# Altium project AvtomotiveServo.PrjPcb
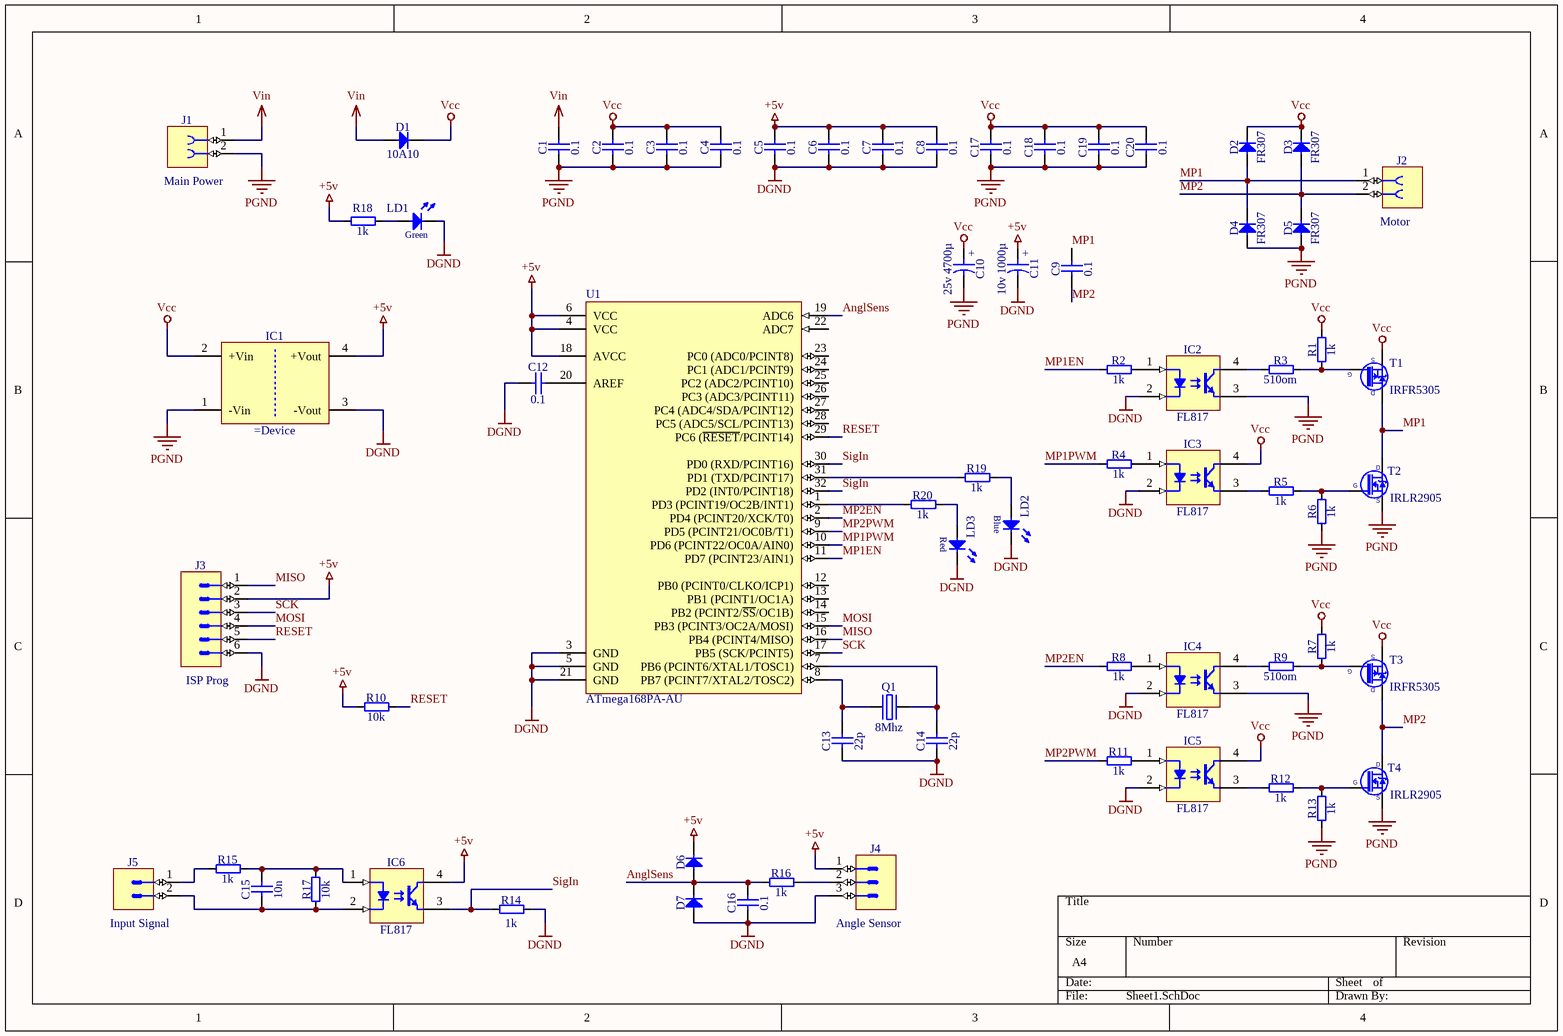
[diagram p0: Sheet1.SchDoc]
1 sheet, 67 parts. Net scope: global (net labels, ports and power ports of the same name join across sheets).
Board file: PCB1.PcbDoc

## Sheet Sheet1.SchDoc
size A4; DrawnBy: Sobchuk Denis

### Parts
C1  0.1  [0402]
C2  0.1  [0402]
C3  0.1  [0402]
C4  0.1  [0402]
C5  0.1  [0402]
C6  0.1  [0402]
C7  0.1  [0402]
C8  0.1  [0402]
C9  0.1  [0402]
C10  25v 4700µ  [Cap25v4700mkf]
C11  10v 1000µ  [CAPPR350W80D850H1300]
C12  0.1  [0402]
C13  22p  [0402]
C14  22p  [0402]
C15  10n  [0402]
C16  0.1  [0402]
C17  0.1  [0402]
C18  0.1  [0402]
C19  0.1  [0402]
C20  0.1  [0402]
D1  10A10  [10A10]
D2  FR307  [DO-27]
D3  FR307  [DO-27]
D4  FR307  [DO-27]
D5  FR307  [DO-27]
D6  (no value)  [DIOMELF3515N]
D7  (no value)  [DIOMELF3515N]
IC1  (no value)  [DCDC_TRACO_TME24]
IC2  FL817  [DIP-4]
IC3  FL817  [DIP-4]
IC4  FL817  [DIP-4]
IC5  FL817  [DIP-4]
IC6  FL817  [DIP-4]
J1  Main Power  [PwrCon]
J2  Motor  [PwrCon]
J3  ISP Prog  [COMATEL_389.0358.1.06.400]
J4  Angle Sensor  [MOLEX_22-05-7038]
J5  Input Signal  [MOLEX_22-05-7028]
LD1  (no value)  [LED_5MM_GREEN_1C-2A]
LD2  (no value)  [LED_VISHAY_TSAL6200]
LD3  (no value)  [LED_5MM_RED_1C-2A]
Q1  8Mhz  [XTAL_HC-49/U]
R1  1k  [RES1016-650X250]
R2  1k  [RESC3116X65N]
R3  510om  [RES1016-650X250]
R4  1k  [RESC3116X65N]
R5  1k  [RES1016-650X250]
R6  1k  [RES1016-650X250]
R7  1k  [RES1016-650X250]
R8  1k  [RESC3116X65N]
R9  510om  [RES1016-650X250]
R10  10k  [RESC3116X65N]
R11  1k  [RESC3116X65N]
R12  1k  [RES1016-650X250]
R13  1k  [RES1016-650X250]
R14  1k  [RESC3116X65N]
R15  1k  [RESC3116X65N]
R16  1k  [RESC3116X65N]
R17  10k  [RESC3116X65N]
R18  1k  [RESC3116X65N]
R19  1k  [RESC3116X65N]
R20  1k  [RESC3116X65N]
T1  IRFR5305  [TO228P991X239-3N-R546X521]
T2  IRLR2905  [TO228P991X239-3N-R546X521]
T3  IRFR5305  [TO228P991X239-3N-R546X521]
T4  IRLR2905  [TO228P991X239-3N-R546X521]
U1  ATmega168PA-AU  [32A_M]

### Nets
+5v: C5.2 C6.2 C7.2 C8.2 C11.1 D6.1(C) IC1.4(+Vout) IC6.4(C) J3.2 J4.1 R10.1 R18.1 U1.4(VCC) U1.6(VCC) U1.18(AVCC)
DGND: C5.1 C6.1 C7.1 C8.1 C11.2 C12.1 C13.1 C14.1 C16.1 D7.2(A) IC1.3(-Vout) IC2.2(C) IC3.2(C) IC4.2(C) IC5.2(C) J3.6 J4.3 LD1.1(C) LD2.1(C) LD3.1(C) R14.2 U1.3(GND) U1.5(GND) U1.21(GND)
PGND: C1.1 C2.1 C3.1 C4.1 C10.2 C17.1 C18.1 C19.1 C20.1 D4.2(A) D5.2(A) IC1.1(-Vin) IC2.3(E) IC4.3(E) J1.2 R6.1 R13.1 T2.2(S) T4.2(S)
Vcc: C2.2 C3.2 C4.2 C10.1 C17.2 C18.2 C19.2 C20.2 D1.1(C) D2.1(C) D3.1(C) IC1.2(+Vin) IC3.4(C) IC5.4(C) R1.2 R7.2 T1.2(S) T3.2(S)
Vin: C1.2 D1.2(A) J1.1
AnglSens: C16.2 D6.2(A) D7.1(C) R16.1 U1.19(ADC6)
MISO: J3.1 U1.16(PB4_(PCINT4/MISO))
MOSI: J3.4 U1.15(PB3_(PCINT3/OC2A/MOSI))
MP1: C9.2 D2.2(A) D4.1(C) J2.1 T1.3(D) T2.3(D)
MP1EN: R2.1 U1.11(PD7_(PCINT23/AIN1))
MP1PWM: R4.1 U1.10(PD6_(PCINT22/OC0A/AIN0))
MP2: C9.1 D3.2(A) D5.1(C) J2.2 T3.3(D) T4.3(D)
MP2EN: R8.1 U1.2(PD4_(PCINT20/XCK/T0))
MP2PWM: R11.1 U1.9(PD5_(PCINT21/OC0B/T1))
RESET: J3.5 R10.2 U1.29(PC6_(~{RESET}/PCINT14))
SCK: J3.3 U1.17(PB5_(SCK/PCINT5))
SigIn: IC6.3(E) R14.1 U1.30(PD0_(RXD/PCINT16)) U1.32(PD2_(INT0/PCINT18))
NetC12_2: C12.2 U1.20(AREF)
NetC13_2: C13.2 Q1.1(OSC1) U1.8(PB7_(PCINT7/XTAL2/TOSC2))
NetC14_2: C14.2 Q1.2(OSC2) U1.7(PB6_(PCINT6/XTAL1/TOSC1))
NetC15_1: C15.1 IC6.2(C) J5.2 R17.1
NetC15_2: C15.2 IC6.1(A) R15.2 R17.2
NetIC2_1: IC2.1(A) R2.2
NetIC2_4: IC2.4(C) R3.1
NetIC3_1: IC3.1(A) R4.2
NetIC3_3: IC3.3(E) R5.1
NetIC4_1: IC4.1(A) R8.2
NetIC4_4: IC4.4(C) R9.1
NetIC5_1: IC5.1(A) R11.2
NetIC5_3: IC5.3(E) R12.1
NetJ4_2: J4.2 R16.2
NetJ5_1: J5.1 R15.1
NetLD1_2: LD1.2(A) R18.2
NetLD2_2: LD2.2(A) R19.2
NetLD3_2: LD3.2(A) R20.2
NetR1_1: R1.1 R3.2 T1.1(G)
NetR5_2: R5.2 R6.2 T2.1(G)
NetR7_1: R7.1 R9.2 T3.1(G)
NetR12_2: R12.2 R13.2 T4.1(G)
NetR19_1: R19.1 U1.31(PD1_(TXD/PCINT17))
NetR20_1: R20.1 U1.1(PD3_(PCINT19/OC2B/INT1))

Not connected (* = marked no-connect by the designer): U1 12(PB0_(PCINT0/CLKO/ICP1)) 13(PB1_(PCINT1/OC1A)) 14(PB2_(PCINT2/~{SS}/OC1B)) 22(ADC7) 23(PC0_(ADC0/PCINT8)) 24(PC1_(ADC1/PCINT9)) 25(PC2_(ADC2/PCINT10)) 26(PC3_(ADC3/PCINT11)) 27(PC4_(ADC4/SDA/PCINT12)) 28(PC5_(ADC5/SCL/PCINT13))

### Notes on the sheet
- (in symbol Capacitor - polarized) +
- (in symbol LED Blue 1C 2A) Blue
- (in symbol LED Green 1C 2A) Green
- (in symbol LED Red 1C 2A) Red

### Library data of the parts
C1-C9 C12-C20 = Capacitor - non polarized: Non-polarised capacitor
C10 C11 = Capacitor - polarized: Polarised capacitor
D1-D7 = Diode
IC1 = DCDC_MURATA_MEE3: 1kV Isolated 3W Single Output DC-DC Converter
IC2-IC6 = Optocoupler Type7: Single Optocoupler
J1 J2 = Connector 2 Female
J3 = Connector 6 Male
J4 = Connector 3 Male
J5 = Connector 2 Male
LD1 = LED Green 1C 2A
LD2 = LED Blue 1C 2A
LD3 = LED Red 1C 2A
Q1 = Quartz Crystal
R1-R20 = Resistor
T1 T3 = P-MOSFET-DZ 1G 2S 3D: P-CHANNEL MOSFET WITH ZENER DIODE
T2 T4 = N-MOSFET-DZ 1G 2S 3D: N-CHANNEL MOSFET WITH ZENER DIODE
U1 = CMP-0095-00244-2: 8-bit AVR Microcontroller, 16KB Flash, 512 Bytes EEPROM, 1KB SRAM, 32-pin TQFP, Industrial Grade (-40°C to 85°C); ComponentLink1URL: http://www.atmel.com/; ComponentLink2Description: ATmega48A/48PA/88A/88PA/168A/168PA/328/328P Datasheet; PackageDescription: 32-Lead, 7x7x1.0 mm Body, 0.8mm Lead Pitch, Thin Profile Plastic Quad Flat Package (TQFP); PackageReference: 32A; Code_JEDEC: MS-026-ABA; ComponentLink3Description: ATmega48A/48PA/88A/88PA/168A/168PA/328/328P Summary; DatasheetVersion: revD, May-2011; PackageVersion: revC, Oct-2010; ComponentLink3URL: http://www.atmel.com/dyn/resources/prod_documents/8271S.pdf; ComponentLink2URL: http://www.atmel.com/dyn/resources/prod_documents/doc8271.pdf; RevisionNote: DatasheetVersion & PackageVersion updated. URLs added.; ComponentLink1Description: Manufacturer URL